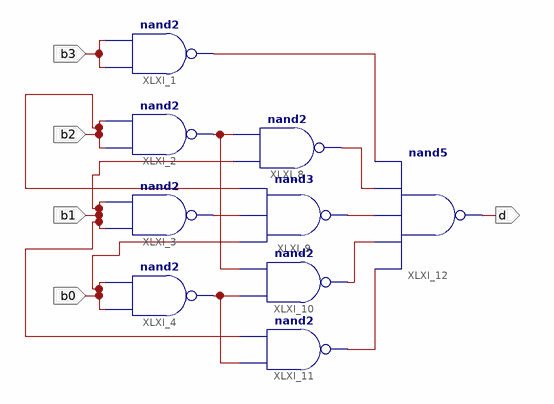
[diagram p0: schematic sheet 1]
// Xilinx ISE schematic d_block.sch (xc9500xl) as structural Verilog: 9 symbols, 5 ports
module d_block (
  input  b3,
  input  b1,
  input  b0,
  input  b2,
  output d
);

  wire XLXN_15, XLXN_16, XLXN_21, XLXN_27, XLXN_28, XLXN_29, XLXN_30, XLXN_31;

  nand XLXI_1 (XLXN_28, b3, b3);
  nand XLXI_2 (XLXN_15, b2, b2);
  nand XLXI_3 (XLXN_16, b1, b1);
  nand XLXI_4 (XLXN_21, b0, b0);
  nand XLXI_8 (XLXN_29, b1, XLXN_15);
  nand XLXI_9 (XLXN_27, b0, XLXN_16, b2);
  nand XLXI_10 (XLXN_30, XLXN_21, XLXN_15);
  nand XLXI_11 (XLXN_31, XLXN_21, b1);
  nand XLXI_12 (d, XLXN_31, XLXN_30, XLXN_27, XLXN_29, XLXN_28);
endmodule
